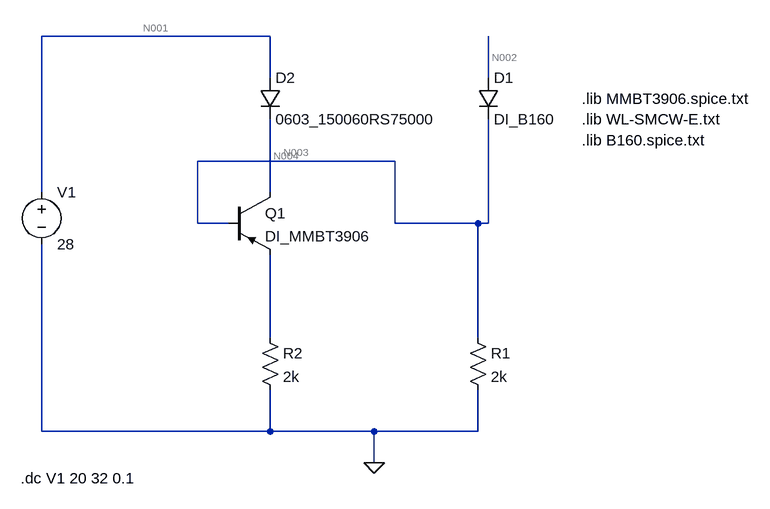
[diagram p0: schematic Working.asc]
Working.asc, the LTspice schematic file:
Version 4
SHEET 1 1452 680
WIRE 112 -464 -240 -464
WIRE 112 -400 112 -464
WIRE 448 -400 448 -464
WIRE 304 -272 0 -272
WIRE -240 -224 -240 -464
WIRE 112 -224 112 -336
WIRE 0 -176 0 -272
WIRE 48 -176 0 -176
WIRE 304 -176 304 -272
WIRE 432 -176 304 -176
WIRE 448 -176 448 -336
WIRE 448 -176 432 -176
WIRE 112 0 112 -128
WIRE 432 0 432 -176
WIRE -240 144 -240 -144
WIRE 112 144 112 80
WIRE 112 144 -240 144
WIRE 272 144 112 144
WIRE 432 144 432 80
WIRE 432 144 272 144
WIRE 272 192 272 144
FLAG 272 192 0
SYMBOL pnp 48 -224 R0
SYMATTR InstName Q1
SYMATTR Value DI_MMBT3906
SYMBOL res 416 -16 R0
SYMATTR InstName R1
SYMATTR Value 2k
SYMATTR SpiceLine pwr=0.05
SYMBOL res 96 -16 R0
SYMATTR InstName R2
SYMATTR Value 2k
SYMATTR SpiceLine pwr=0.05
SYMBOL diode 96 -400 R0
SYMATTR InstName D2
SYMATTR Value 0603_150060RS75000
SYMATTR Description Light Emitting Diode
SYMATTR Type led
SYMBOL voltage -240 -240 R0
WINDOW 123 0 0 Left 0
WINDOW 39 0 0 Left 0
SYMATTR InstName V1
SYMATTR Value 28
SYMBOL diode 432 -400 R0
SYMATTR InstName D1
SYMATTR Value DI_B160
TEXT -272 216 Left 2 !.dc V1 20 32 0.1
TEXT 592 -368 Left 2 !.lib MMBT3906.spice.txt
TEXT 592 -336 Left 2 !.lib WL-SMCW-E.txt
TEXT 592 -304 Left 2 !.lib B160.spice.txt

The netlist it stands for:
* Working.asc
Q1 N004 N003 N005 0 DI_MMBT3906
R1 N003 0 2k pwr=0.05
R2 N005 0 2k pwr=0.05
D2 N001 N004 0603_150060RS75000
V1 N001 0 28
D1 N002 N003 DI_B160
.model D D
.lib standard.dio
.model NPN NPN
.model PNP PNP
.lib standard.bjt
.dc V1 20 32 0.1
.lib MMBT3906.spice.txt
.lib WL-SMCW-E.txt
.lib B160.spice.txt
.backanno
.end

* Results of the author's LTspice run, read from the files saved beside the schematic
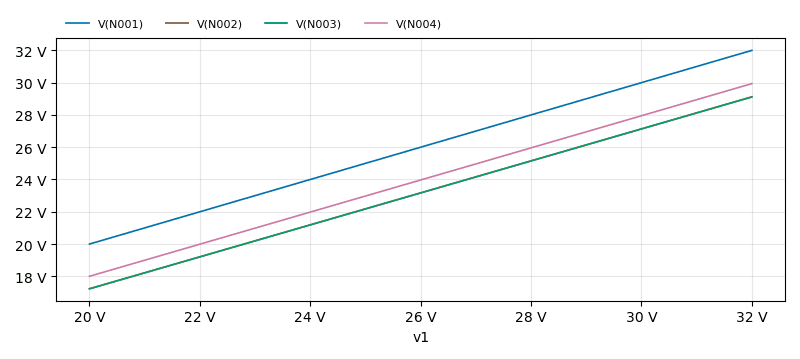
[diagram p1: DC transfer characteristic of Working.asc, plotted from the saved traces]
* DC transfer characteristic, 1 run:
*   V(N001): 20 V at v1=20 V, 32 V at v1=32 V, min 20 V, max 32 V
*   V(N002): 17.23 V at v1=20 V, 29.12 V at v1=32 V, min 17.23 V, max 29.12 V
*   V(N003): 17.23 V at v1=20 V, 29.12 V at v1=32 V, min 17.23 V, max 29.12 V
*   V(N004): 18 V at v1=20 V, 29.94 V at v1=32 V, min 18 V, max 29.94 V